# Altium schematic sheet LCD_MicroSD_Flash.SchDoc
size A4; Revision: C.2
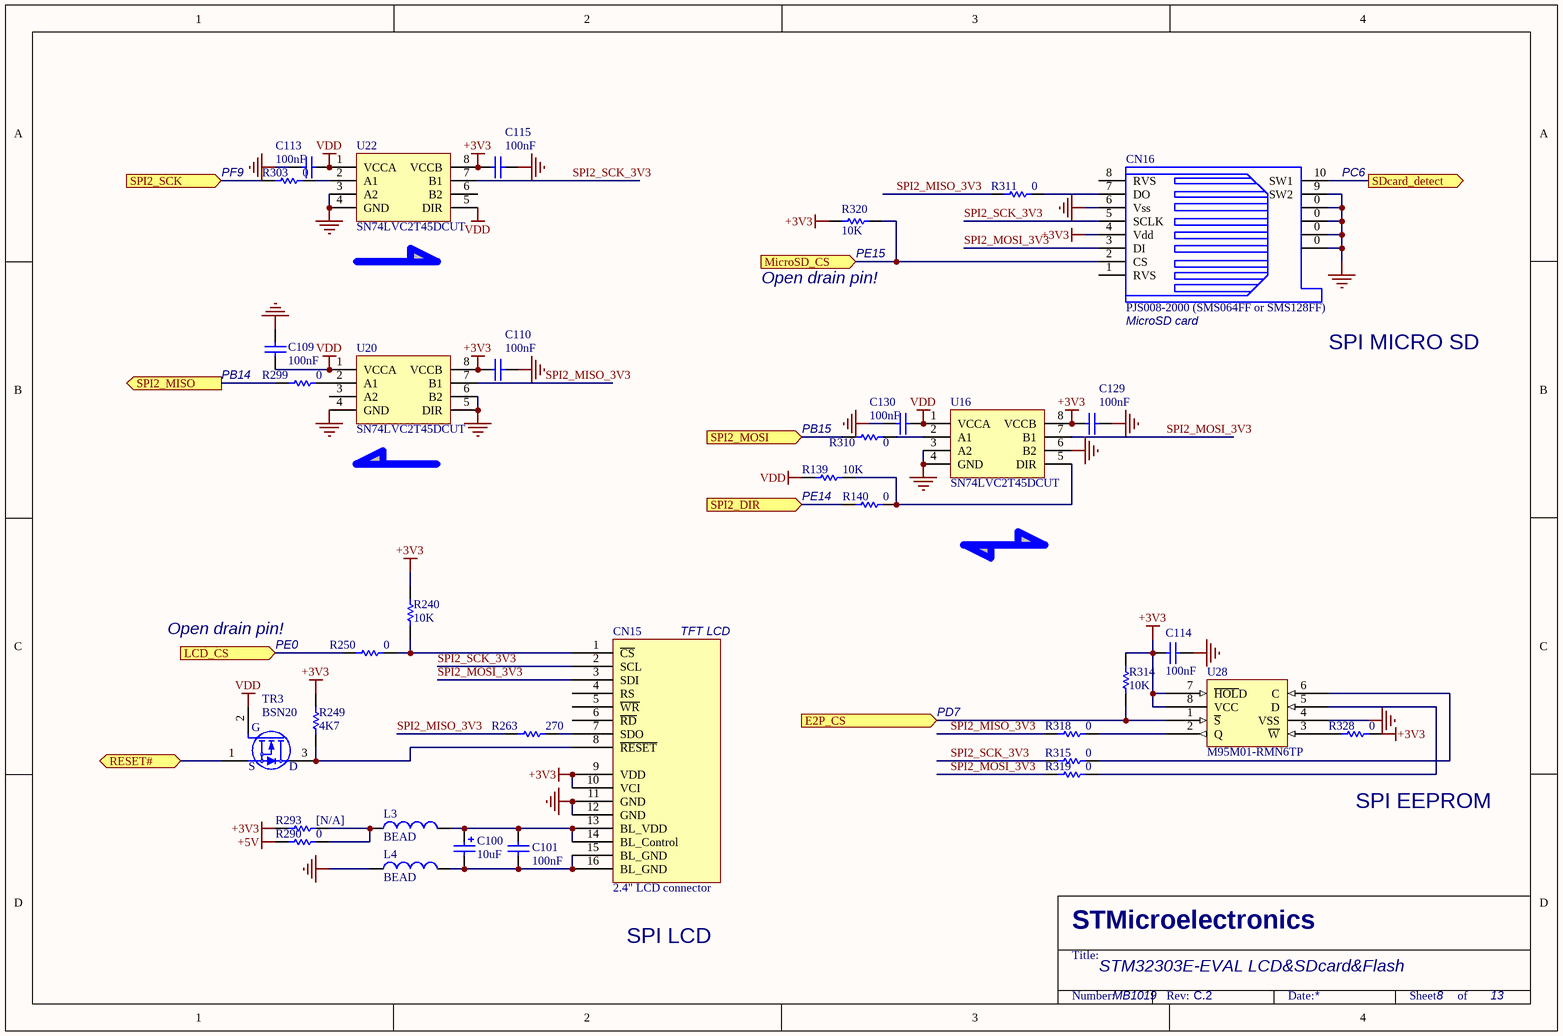
[diagram p0: LCD_MicroSD_Flash.SchDoc]

## Parts
C100  10uF  [TAN-A]
C101  100nF  [0603C]
C109  100nF  [0603C]
C110  100nF  [0603C]
C113  100nF  [0603C]
C114  100nF  [0603C]
C115  100nF  [0603C]
C129  100nF  [0603C]
C130  100nF  [0603C]
CN15  2.4" LCD connector  [MB895CS]
CN16  PJS008-2000 (SMS064FF or SMS128FF)  [MSD(PJS008)]
L3  BEAD  [0603L]
L4  BEAD  [0603L]
R139  10K  [0603R]
R140  0  [0603R]
R240  10K  [0603R]
R249  4K7  [0603R]
R250  0  [0603R]
R263  270  [0603R]
R290  0  [0603R]
R293  [N/A]  [0603R]
R299  0  [0603R]
R303  0  [0603R]
R310  0  [0603R]
R311  0  [0603R]
R314  10K  [0603R]
R315  0  [0603R]
R318  0  [0603R]
R319  0  [0603R]
R320  10K  [0603R]
R328  0  [0603R]
TR3  BSN20  [SOT-23]
U16  SN74LVC2T45DCUT  [VSSOP8]
U20  SN74LVC2T45DCUT  [VSSOP8]
U22  SN74LVC2T45DCUT  [VSSOP8]
U28  M95M01-RMN6TP  [SO8]

## Ports
E2P_CS (in), LCD_CS (in), MicroSD_CS (in), RESET# (bidir), SDcard_detect (out), SPI2_DIR (in), SPI2_MISO (out), SPI2_MOSI (in), SPI2_SCK (in)

## Nets
+3V3: C110.2 C114.1 C115.2 C129.2 CN15.9(VDD) CN15.10(VCI) CN16.4(Vdd) R240.2 R249.2 R293.1 R314.1 R320.2 R328.1 U16.8(VCCB) U20.8(VCCB) U22.8(VCCB) U28.7(~{HOL}D) U28.8(VCC)
+5V: R290.1
GND: C109.1 C110.1 C113.1 C114.2 C115.1 C129.1 C130.1 CN15.11(GND) CN15.12(GND) CN16.0 CN16.6(Vss) CN16.9(SW2) L4.1 U16.3(A2) U16.4(GND) U16.6(B2) U20.4(GND) U20.5(DIR) U20.6(B2) U22.3(A2) U22.4(GND) U28.4(VSS)
VDD: C109.2 C113.2 C130.2 R139.2 TR3.2(G) U16.1(VCCA) U20.1(VCCA) U22.1(VCCA) U22.5(DIR)
E2P_CS: R314.2 U28.1(~{S}) ; port E2P_CS
LCD_CS: R250.1 ; port LCD_CS
MicroSD_CS: CN16.2(CS) R320.1 ; port MicroSD_CS
RESET#: TR3.1(S) ; port RESET#
SDcard_detect: CN16.10(SW1) ; port SDcard_detect
SPI2_DIR: R140.2 ; port SPI2_DIR
SPI2_MISO: R299.1 ; port SPI2_MISO
SPI2_MISO_3V3: R263.1 R311.1 R318.2 U20.7(B1)
SPI2_MOSI: R310.2 ; port SPI2_MOSI
SPI2_MOSI_3V3: CN15.3(SDI) CN16.3(DI) R319.2 U16.7(B1)
SPI2_SCK: R303.2 ; port SPI2_SCK
SPI2_SCK_3V3: CN15.2(SCL) CN16.5(SCLK) R315.2 U22.7(B1)
NetC100_1: C100.1 C101.1 CN15.13(BL_VDD) CN15.14(BL_Control) L3.2
NetC100_2: C100.2 C101.2 CN15.15(BL_GND) CN15.16(BL_GND) L4.2
NetCN15_1: CN15.1(~{CS}) R240.1 R250.2
NetCN15_7: CN15.7(SDO) R263.2
NetCN15_8: CN15.8(~{RESET}) R249.1 TR3.3(D)
NetCN16_7: CN16.7(DO) R311.2
NetL3_1: L3.1 R290.2 R293.2
NetR139_1: R139.1 R140.1 U16.5(DIR)
NetR299_2: R299.2 U20.2(A1)
NetR303_1: R303.1 U22.2(A1)
NetR310_1: R310.1 U16.2(A1)
NetR315_1: R315.1 U28.6(C)
NetR318_1: R318.1 U28.2(Q)
NetR319_1: R319.1 U28.5(D)
NetR328_2: R328.2 U28.3(~{W})

Not connected (* = marked no-connect by the designer): CN15 4(RS) 5(~{WR}) 6(~{RD}); CN16 1(RVS) 8(RVS); U20 3(A2); U22 6(B2)

## Notes on the sheet
- (near R303) PF9
- (near CN16) PC6
- (near R320) Open drain pin!
- (near R320) PE15
- PB14
- (near CN16) MicroSD card
- SPI MICRO SD
- PB15
- (near R139) PE14
- Open drain pin!
- PE0
- TFT LCD
- PD7
- SPI EEPROM
- SPI LCD
- STM32303E-EVAL LCD&SDcard&Flash
- MB1019
- 8
- 13
- STMicroelectronics
- Title:
- Number:
- Rev:
- Date:
- Sheet       of

## Library data of the parts
C100 = Cap Pol1: Polarized Capacitor (Radial); Published: 8-Jun-2000; Revision: July-2002: Re-released for DXP Platform.; Publisher: Altium Limited; Value: 10uF
C101 C114 = Cap: Capacitor; Value: 10nF; Published: 8-Jun-2000; Revision: July-2002: Re-released for DXP Platform.; Publisher: Altium Limited
C109 C110 C113 C115 C129 C130 = CAP: Capacitor; Value: 100pF; Published: 8-Jun-2000; Revision: July-2002: Re-released for DXP Platform.; Publisher: Altium Limited
CN15 = ColorLCD_module
CN16 = SMS016AFA5E
L3 L4 = Inductor: Value: 100uH; Published: 8-Jun-2000; Revision: July-2002: Re-released for DXP Platform.; Publisher: Altium Limited
R139 R140 R240 R249 R250 R263 R290 R293 R299 R311 R315 R318-R320 R328 = Res1: Resistor; Value: 1K; Published: 8-Jun-2000; Revision: July-2002: Re-released for DXP Platform.; Publisher: Altium Limited
R303 R310 R314 = res1: Resistor; Value: 1K; Published: 8-Jun-2000; Revision: July-2002: Re-released for DXP Platform.; Publisher: Altium Limited
TR3 = 2N7000
U28 = M95040-R